# Altium schematic sheet Main.SchDoc
size A4 portrait; SheetNumber: 1; SheetTotal: 1; ENG_APP_DATE: --/--/--; DSN_APP_DATE: --/--/--; CHK_APP_DATE: --/--/--
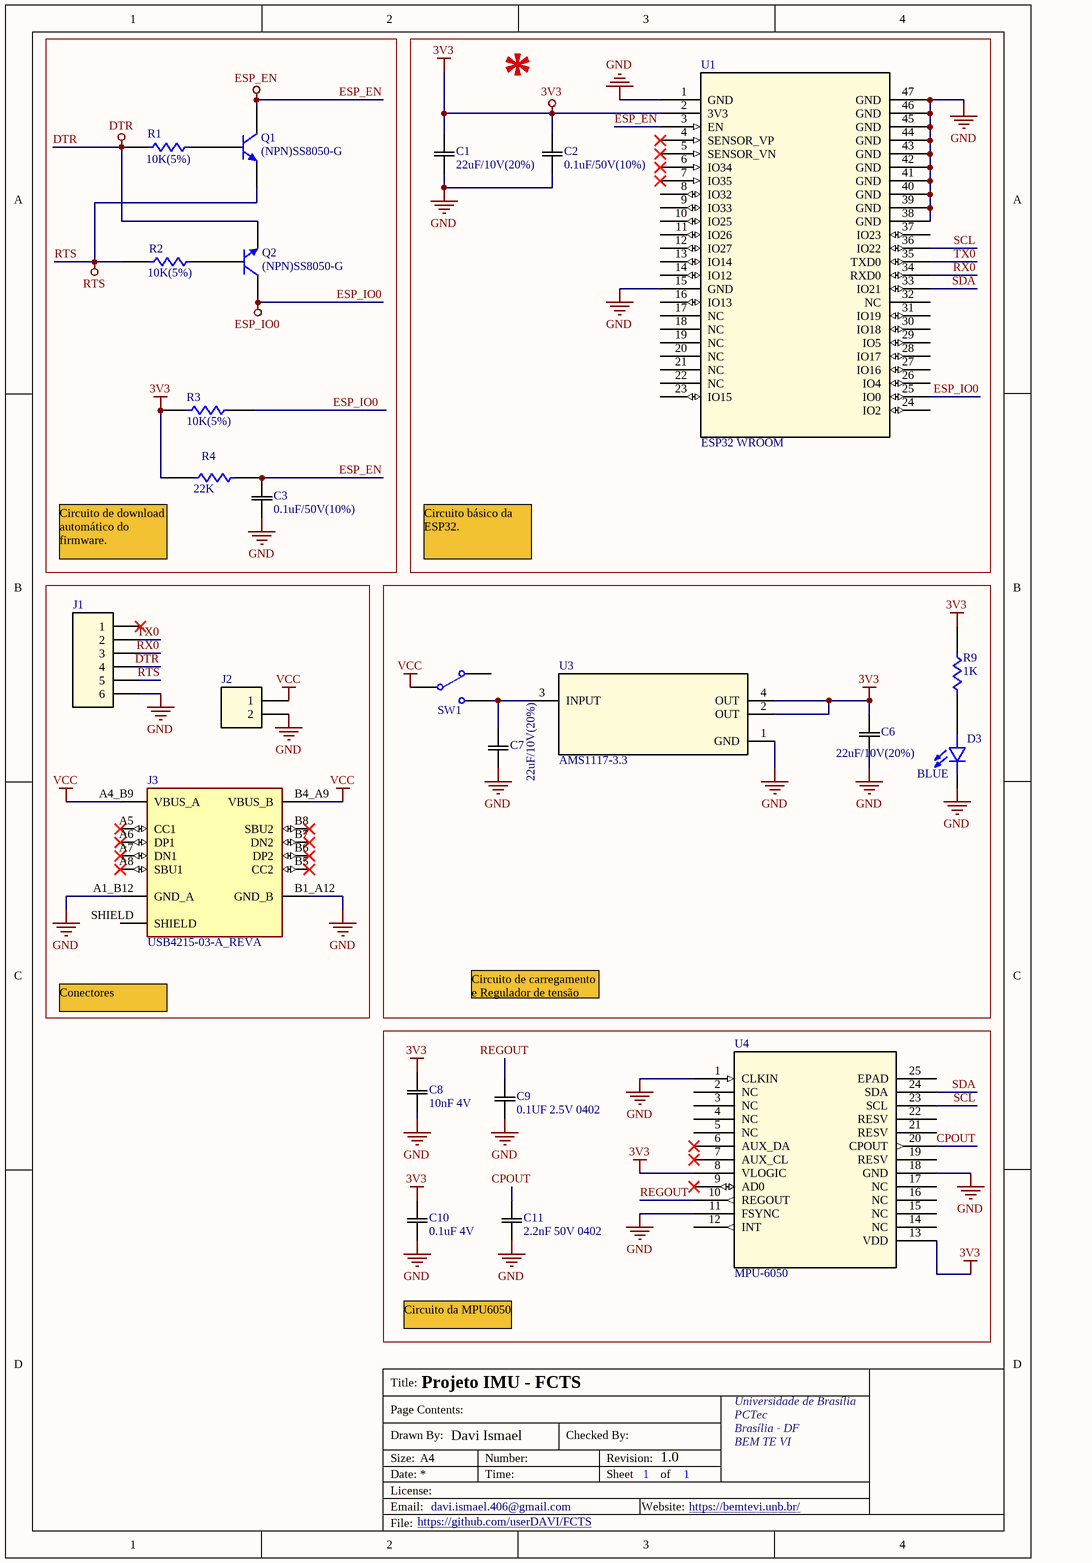
[diagram p0: Main.SchDoc]

## Parts
C1  22uF/10V(20%)  [CAP_LMK212B_2X1P25_TAY-M]
C2  0.1uF/50V(10%)  [CC0603N_YAG]
C3  0.1uF/50V(10%)  [CC0603N_YAG]
C6  22uF/10V(20%)  [CAP_LMK212B_2X1P25_TAY-M]
C7  22uF/10V(20%)  [CAP_LMK212B_2X1P25_TAY-M]
C8  10nF 4V  [CAP_02013J0R1PBSTR500]
C9  0.1UF 2.5V 0402  [CAPC0201X13N]
C10  0.1uF 4V  [CAPC1608X90N]
C11  2.2nF 50V 0402  [CAPC10555_55N_KEM]
D3  BLUE  [LED_KP-1608SURCK]
J1  G800W302018EU  [CONN6x1_G800W302018EU_AMP]  (value not drawn)
J2  M20-9990246  [CONN2_M20-999_1x2_HRW]  (value not drawn)
J3  USB4215-03-A_REVA  [GCT_USB4215-03-A_REVA]
Q1  (NPN)SS8050-G  [(NPN)SS8050-G]
Q2  (NPN)SS8050-G  [(NPN)SS8050-G]
R1  10K(5%)  [STA_RMCF0603_STP-M]
R2  10K(5%)  [STA_RMCF0603_STP-M]
R3  10K(5%)  [STA_RMCF0603_STP-M]
R4  22K  [RC0603N_YAG]
R9  1K  [STA_RMCF0603_STP-M]
SW1  Mini Slide Switch  [450404015514]  (value not drawn)
U1  ESP32 WROOM  [MOD_ESP32-WROOM-32_EXP]
U3  AMS1117-3.3  [AMS1117-3.3]
U4  MPU-6050  [QFN24_4X4X0P9-0P5_TDK-M]

## Nets
3V3: C1.2 C2.2 C6.2 C8.2(EPAD) C10.2 R3.2 R4.1 R9.1 U1.2(3V3) U3.2(OUT) U3.4(OUT) U4.8(VLOGIC) U4.13(VDD)
DTR: J1.4 Q2.3(E) R1.1
ESP_EN: C3.2 Q1.1(C) R4.2 U1.3(EN)
ESP_IO0: Q2.1(C) R3.1 U1.25(IO0)
GND: C1.1 C2.1 C3.1 C6.1 C7.1 C8.1(EPAD) C9.1 C10.1 C11.1 D3.2(C) J1.6 J2.2 J3.A1_B12(GND_A) J3.B1_A12(GND_B) U1.1(GND) U1.15(GND) U1.38(GND) U1.39(GND) U1.40(GND) U1.41(GND) U1.42(GND) U1.43(GND) U1.44(GND) U1.45(GND) U1.46(GND) U1.47(GND) U3.1(GND) U4.1(CLKIN) U4.11(FSYNC) U4.18(GND)
RTS: J1.5 Q1.3(E) R2.1
VCC: J2.1 J3.A4_B9(VBUS_A) J3.B4_A9(VBUS_B) SW1.COM
CPOUT: C11.2 U4.20(CPOUT)
REGOUT: C9.2 U4.10(REGOUT)
RX0: J1.3 U1.34(RXD0)
SCL: U1.36(IO22) U4.23(SCL)
SDA: U1.33(IO21) U4.24(SDA)
TX0: J1.2 U1.35(TXD0)
NetC7_2: C7.2 SW1.L2 U3.3(INPUT)
NetD3_1: D3.1(A) R9.2
NetQ1_2: Q1.2(B) R1.2
NetQ2_2: Q2.2(B) R2.2

Not connected (* = marked no-connect by the designer): J1 1*; J3 A5(CC1)* A6(DP1)* A7(DN1)* A8(SBU1)* B5(CC2)* B6(DP2)* B7(DN2)* B8(SBU2)* SHIELD; SW1 L1; U1 4(SENSOR_VP)* 5(SENSOR_VN)* 6(IO34)* 7(IO35)* 8(IO32) 9(IO33) 10(IO25) 11(IO26) 12(IO27) 13(IO14) 14(IO12) 16(IO13) 17(NC) 18(NC) 19(NC) 20(NC) 21(NC) 22(NC) 23(IO15) 24(IO2) 26(IO4) 27(IO16) 28(IO17) 29(IO5) 30(IO18) 31(IO19) 32(NC) 37(IO23); U4 2(NC) 3(NC) 4(NC) 5(NC) 6(AUX_DA)* 7(AUX_CL)* 9(AD0)* 12(INT) 14(NC) 15(NC) 16(NC) 17(NC) 19(RESV) 21(RESV) 22(RESV) 25(EPAD)

## Notes on the sheet
- (near R4) Circuito de download automático do firmware.
- Circuito básico da ESP32.
- Conectores
- Circuito de carregamento e Regulador de tensão
- Circuito da MPU6050
- Title:
- Projeto IMU - FCTS
- Drawn By:
- Page Contents:
- Davi Ismael
- Checked By:
- 1.0
- Universidade de Brasília
- PCTec
- Brasília - DF
- BEM TE VI
- Size:
- Date:
- File:
- License:
- Email:
- A4
- davi.ismael.406@gmail.com
- Number:
- Time:
- Revision:
- Sheet
- Website:
- of
- https://bemtevi.unb.br/
- https://github.com/userDAVI/FCTS

## Library data of the parts
C1 C6 C7 = LMK212BBJ226MG-T: No Description Available; Mfr_Name: Taiyo Yuden; Supplier Part Number 1: 587-5464-1-ND; Supplier 1: Digikey
C2 C3 = CC0603KRX7R7BB104: No Description Available; Mfr_Name: Yageo; Supplier 1: Future Electronics; Supplier Part Number 1: 2938116
C8 = 02014D103KAT2A: Ceramic, X7R, 10nF ±10%, 4V; Mfr_Name: KYOCERA AVX; Supplier 1: Mouser; Supplier Part Number 1: 581-02014D103KAT2A
C9 = GRM152D70E104KE19D: CAP CER 0.1UF 2.5V X7T 0402; Package: None; Price: None; Value: *; MP: GRM152D70E104KE19D; Availability: Unavailable; Supplier 1: Digikey; Supplier Part Number 1: GRM152D70E104KE19D-ND
C10 = 06034C104KAT2A: CAP CER 0.1UF 4V X7R 0603; Package: None; Price: None; Value: *; MP: 06034C104KAT2A; Availability: Unavailable; Supplier 1: Digikey; Supplier Part Number 1: 478-06034C104KAT2ACT-ND
C11 = C0402C222K5RECAUTO7411: CAP CER 0402 2.2NF 50V X7R 10%; Mfr_Name: Kemet; Supplier 1: Mouser; Supplier Part Number 1: 80-C0402C222K5REAULR
D3 = 150060BS55040: Single Color LEDs WL-SMCD SMD Mono SMD 0603 Blue 465nm; MF: Kingbright; MP: KP-1608SURCK; SnapEDA_Link: https://www.snapeda.com/parts/KP-1608SURCK/Kingbright/view-part/?ref=snap; Package: 0603 Kingbright; Value: *; Check_prices: https://www.snapeda.com/parts/KP-1608SURCK/Kingbright/view-part/?ref=eda
J1 = G800W302018EU: No Description Available; Mfr_Name: Amphenol ICC; Type: Headers, Male Pins; RefDes: RefDes
J2 = M20-9990246: header 2x1; Mfr_Name: Harwin; RefDes: RefDes; Type: Type
J3 = USB4215-03-A_REVA: Type C USB 2.0 Connector; MF: Global Connector Technology; SnapEDA_Link: https://www.snapeda.com/parts/USB4215-03-A/Global+Connector+Technology/view-part/?ref=snap; Package: None; Value: *; MP: USB4215-03-A; Check_prices: https://www.snapeda.com/parts/USB4215-03-A/Global+Connector+Technology/view-part/?ref=eda
Q1 Q2 = (NPN)SS8050-G: No Description Available; Mfr_Name: Comchip; RefDes: RefDes; Type: Type
R1-R3 = RMCF0603JT10K0: No Description Available; Mfr_Name: Stackpole International; Supplier 1: Digikey; Supplier Part Number 1: RMCF0603JT10K0CT-ND
R4 = RC0603FR-0722KL: No Description Available; Mfr_Name: Yageo; Supplier 1: Future Electronics; Supplier Part Number 1: 1933787
R9 = RK73H1JRTTD1001D: RES 1K; Mfr_Name: Stackpole International; Supplier 1: Mouser; Supplier Part Number 1: 660-RK73H1JRTTD1001D
SW1 = 450404015514: WS-SLSU Mini Slide Switch, Same Side Connection Side Push, SPDT, 5VDC, 300mA, 240g; Manufacturer: Wurth Elektronik; ComponentLink1Description: Website Link; ComponentLink1URL: https://www.we-online.com/redexpert/article/450404015514?ad; ComponentLink2Description: Datasheet Link; ComponentLink2URL: https://www.we-online.com/redexpert/spec/450404015514?ad; Manufacturer Part Number: 450404015514; Category: Slide Switches; Match Code: WS-SLSU; Mount: Surface Mount; Operating Temperature Max: 85°C; Operating Temperature Min: -40°C; Packaging: Tape and Reel; Length: 6.7mm; Width: 2.7mm; Height: 1.1mm; Circuit: SPDT; Contact Material: Copper Alloy; Contact Plating: Silver; Operation Force: 240g; Rated Current: 300mA; Rated Voltage: 5VDC; Terminal Material: Copper Alloy; Terminal Plating: Silver; Supplier 1: Digikey; Supplier Part Number 1: 732-13665-1-ND
U3 = AMS1117-3.3: No Description Available; Mfr_Name: Texas Instruments; TYPE: TYPE; RefDes: RefDes; Supplier 1: Digikey; Supplier Part Number 1: 4518-AMS1117-3.3CT-ND
U4 = MPU-6050: No Description Available; Mfr_Name: TDK; Type: Motion Sensors; RefDes: RefDes; Supplier 1: Newark; Supplier Part Number 1: 37T8113
U1 = ESP32 WROOM: Supplier 1: Digikey; Supplier Part Number 1: 1904-ESP32-WROOM-32E(M113EH3200PH3Q0)TR-ND